# EAGLE schematic AIO (EAGLE 6.5.0)
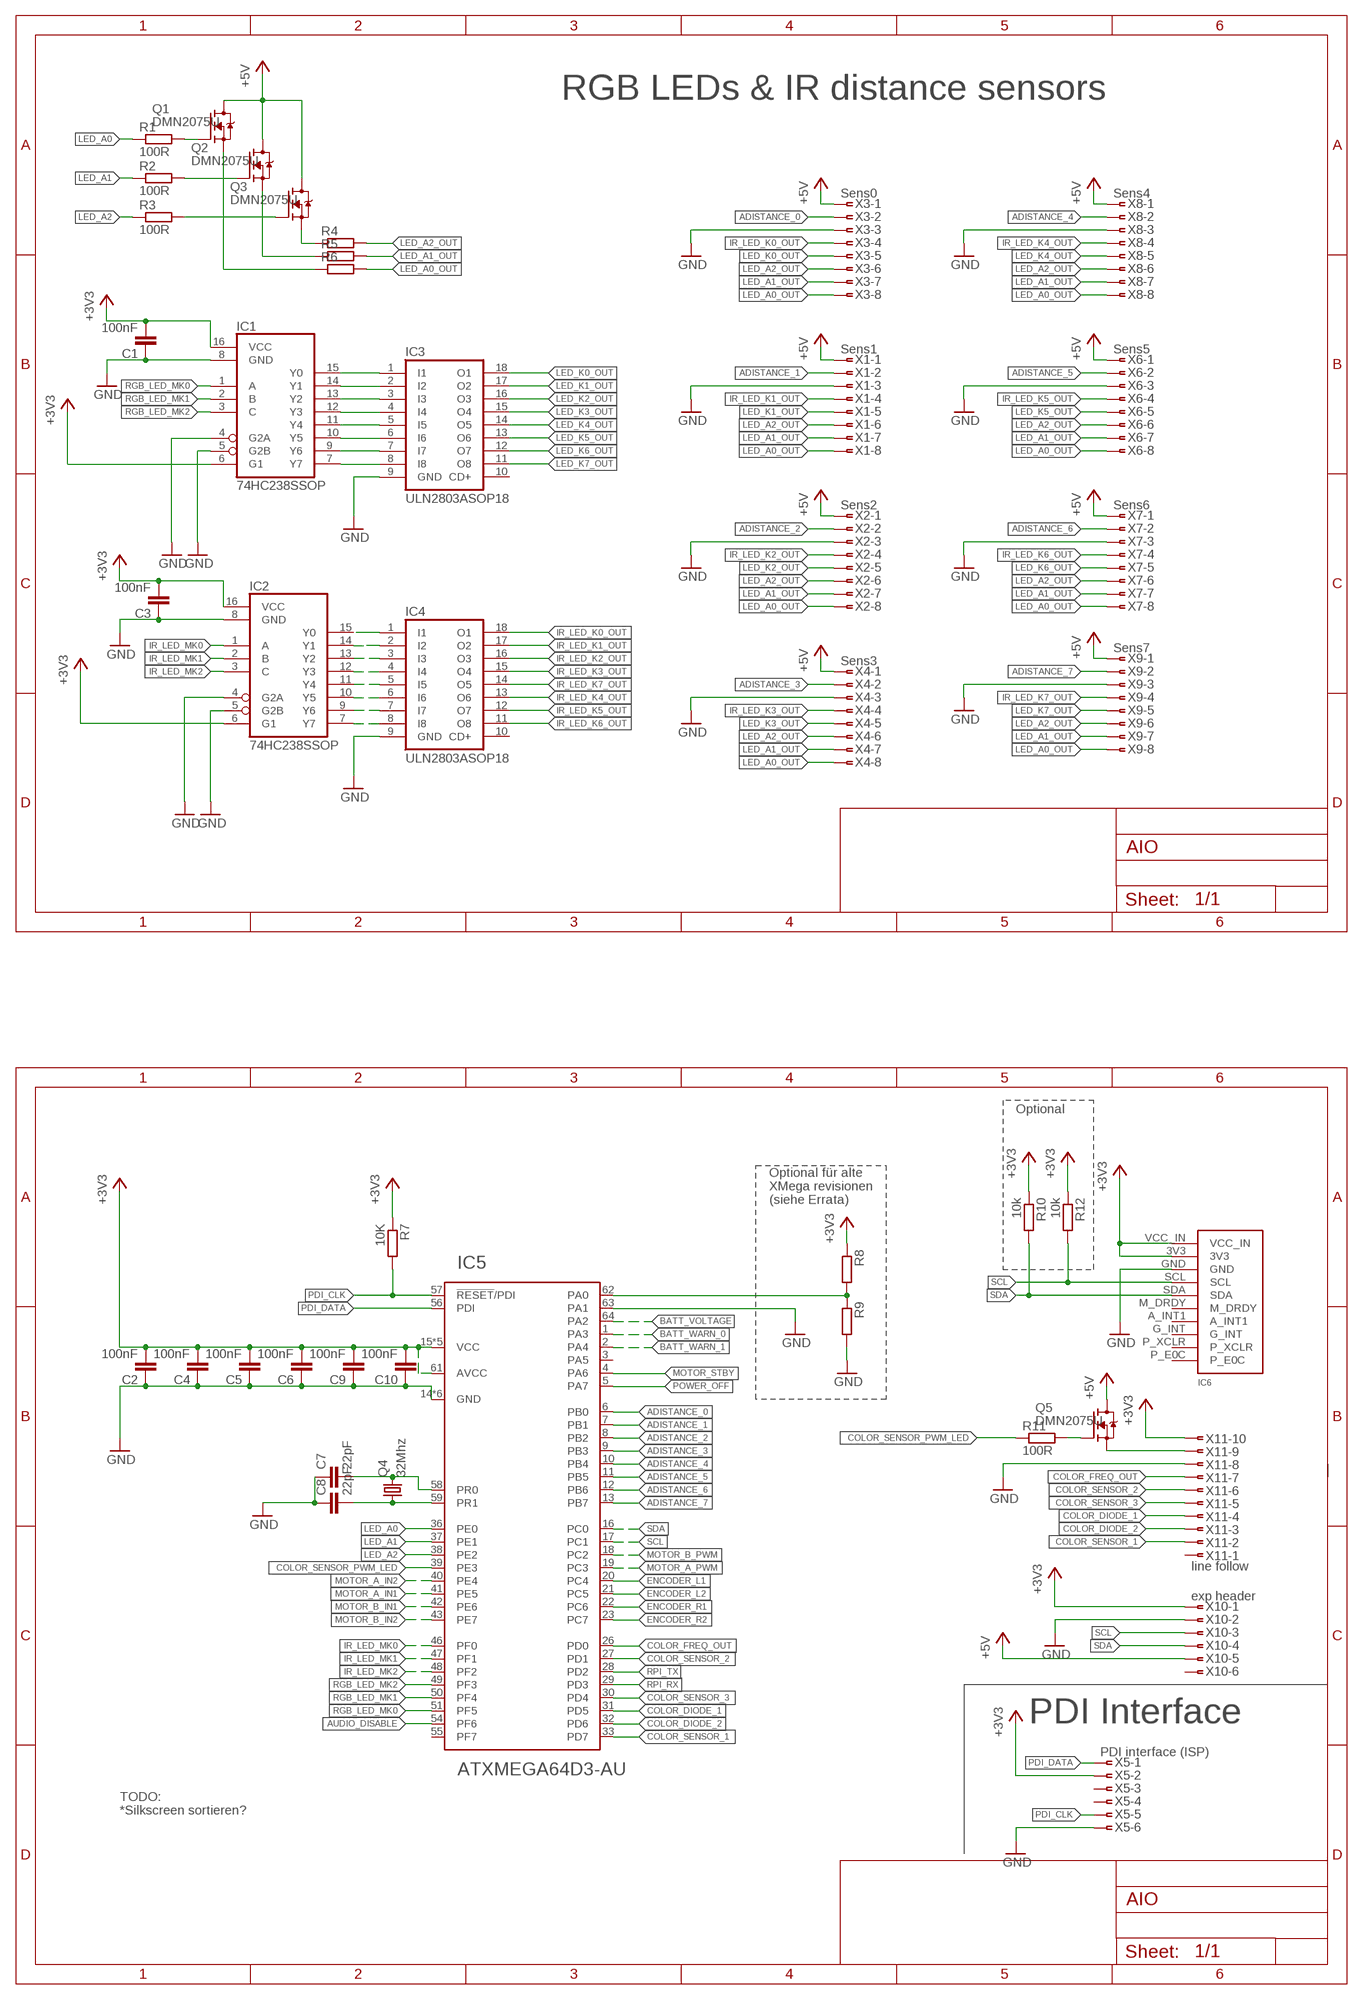
[diagram p0: schematic, sheet 1, part 1 of 2]
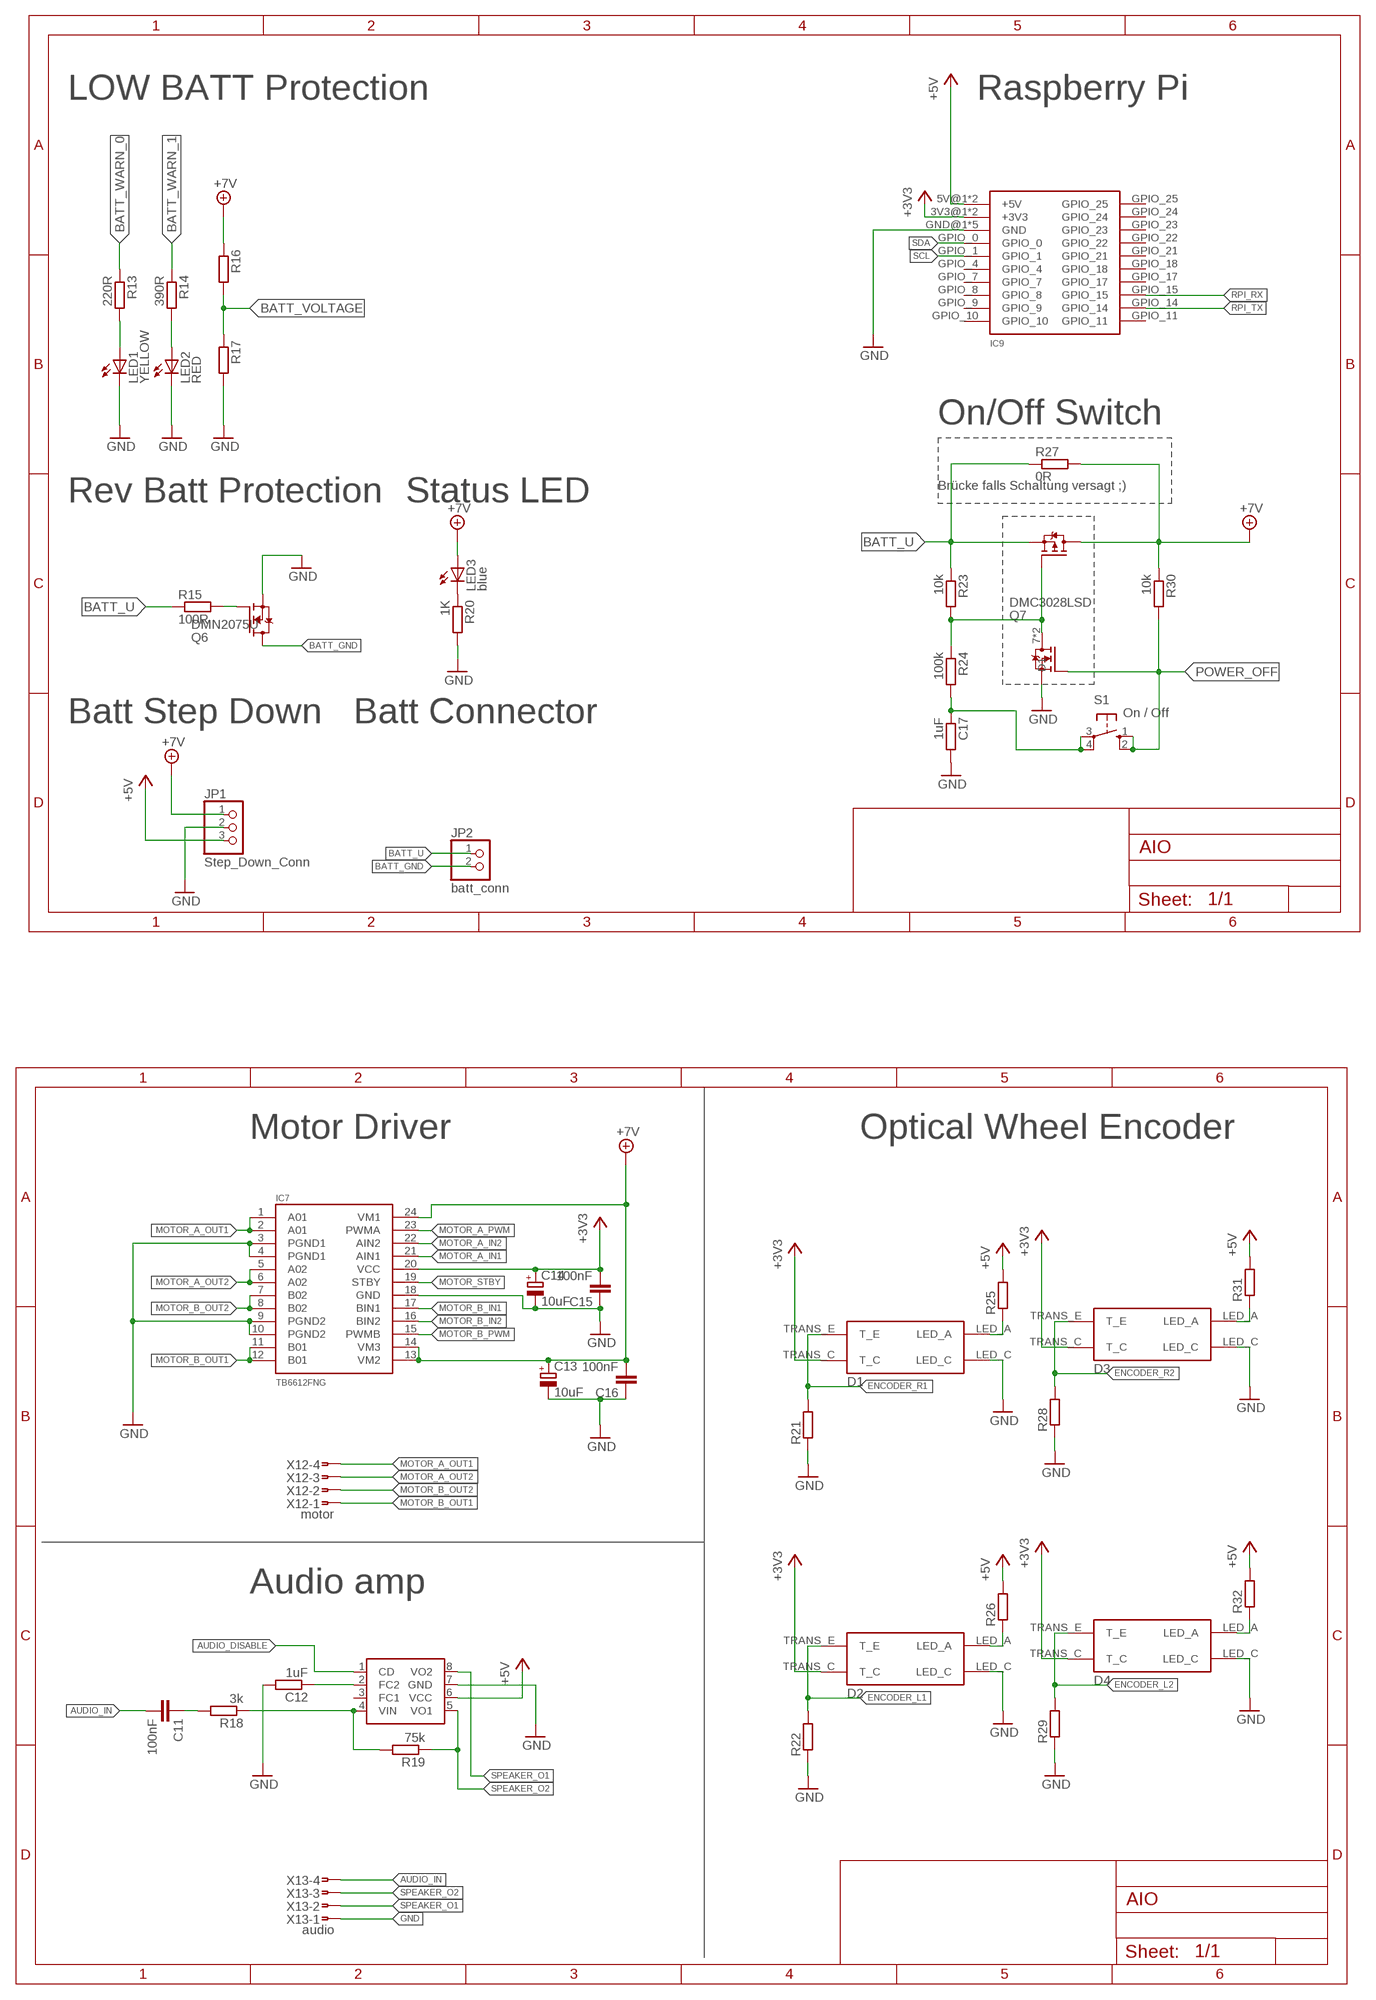
[diagram p1: schematic, sheet 1, part 2 of 2]

## Parts
C1  100nF  C-EUC0603  [C0603]
C2  100nF  C-EUC0603  [C0603]
C3  100nF  C-EUC0603  [C0603]
C4  100nF  C-EUC0603  [C0603]
C5  100nF  C-EUC0603  [C0603]
C6  100nF  C-EUC0603  [C0603]
C7  22pF  C-EUC0603  [C0603]
C8  22pF  C-EUC0603  [C0603]
C9  100nF  C-EUC0603  [C0603]
C10  100nF  C-EUC0603  [C0603]
C11  100nF  C-EUC0603  [C0603]
C12  1uF  R-EU_M0805  [M0805]
C13  10uF  CPOL-EUE2-5  [E2-5]
C14  10uF  CPOL-EUE2-5  [E2-5]
C15  100nF  C-EUC0603  [C0603]
C16  100nF  C-EUC0603  [C0603]
C17  1uF  R-EU_M0805  [M0805]
D1  CNY70  [CNY70]
D2  CNY70  [CNY70]
D3  CNY70  [CNY70]
D4  CNY70  [CNY70]
IC1  74HC238SSOP  [SSOP16]
IC2  74HC238SSOP  [SSOP16]
IC3  ULN2803ASOP18  [SOP18]
IC4  ULN2803ASOP18  [SOP18]
IC5  ATXMEGA64D3-AU  [TQFP-64A-64]
IC6  GY-81  [GY-81]
IC7  TB6612FNG  TB6621FNG  [SSOP24]
IC8  TS34119SMD  [SO08]
IC9  RASPBERRY-PI  [RASPERRRY-PI]
JP1  Step_Down_Conn  PINHD-1X3  [1X03]
JP2  batt_conn  PINHD-1X2  [1X02]
LED1  YELLOW  LEDCHIPLED_0603  [CHIPLED_0603]
LED2  RED  LEDCHIPLED_0603  [CHIPLED_0603]
LED3  blue  LEDCHIPLED_0603  [CHIPLED_0603]
Q1  DMN2075U  [SOT95P240X112-3N]
Q2  DMN2075U  [SOT95P240X112-3N]
Q3  DMN2075U  [SOT95P240X112-3N]
Q4  32Mhz  CRYSTALHC18U-V  [HC18U-V]
Q5  DMN2075U  [SOT95P240X112-3N]
Q6  DMN2075U  [SOT95P240X112-3N]
Q7  DMC3028LSD  [SO08]
R1  100R  R-EU_R0603  [R0603]
R2  100R  R-EU_R0603  [R0603]
R3  100R  R-EU_R0603  [R0603]
R4  R-EU_M0805  [M0805]
R5  R-EU_M0805  [M0805]
R6  R-EU_M0805  [M0805]
R7  10K  R-EU_M0805  [M0805]
R8  R-EU_M0805  [M0805]
R9  R-EU_M0805  [M0805]
R10  10k  R-EU_M0805  [M0805]
R11  100R  R-EU_R0603  [R0603]
R12  10k  R-EU_M0805  [M0805]
R13  220R  R-EU_M0805  [M0805]
R14  390R  R-EU_M0805  [M0805]
R15  100R  R-EU_R0603  [R0603]
R16  R-EU_M0805  [M0805]
R17  R-EU_M0805  [M0805]
R18  3k  R-EU_M0805  [M0805]
R19  75k  R-EU_M0805  [M0805]
R20  1K  R-EU_M0805  [M0805]
R21  R-EU_M0805  [M0805]
R22  R-EU_M0805  [M0805]
R23  10k  R-EU_M0805  [M0805]
R24  100k  R-EU_M0805  [M0805]
R25  R-EU_M0805  [M0805]
R26  R-EU_M0805  [M0805]
R27  0R  R-EU_M0805  [M0805]
R28  R-EU_M0805  [M0805]
R29  R-EU_M0805  [M0805]
R30  10k  R-EU_M0805  [M0805]
R31  R-EU_M0805  [M0805]
R32  R-EU_M0805  [M0805]
S1  On / Off  10-XX  [B3F-10XX]
X1  Sens1  FSIDE-8  [FSIDE-8]
X2  Sens2  FSIDE-8  [FSIDE-8]
X3  Sens0  FTOP-8  [FTOP-8]
X4  Sens3  FTOP-8  [FTOP-8]
X5  PDI interface (ISP)  FTOP-6  [FTOP-6]
X6  Sens5  FSIDE-8  [FSIDE-8]
X7  Sens6  FSIDE-8  [FSIDE-8]
X8  Sens4  FTOP-8  [FTOP-8]
X9  Sens7  FTOP-8  [FTOP-8]
X10  exp header  FTOP-6  [FTOP-6]
X11  line follow  FTOP-10  [FTOP-10]
X12  motor  FTOP-4  [FTOP-4]
X13  audio  FTOP-4  [FTOP-4]

## Nets
+3V3: C1.2 C2.2 C3.2 C4.2 C5.2 C6.2 C9.2 C10.2 C14.+ C15.2 D1.TRANS_C(T_C) D2.TRANS_C(T_C) D3.TRANS_C(T_C) D4.TRANS_C(T_C) IC1.6(G1) IC1.16(VCC) IC2.6(G1) IC2.16(VCC) IC5.15(VCC) IC5.25(VCC) IC5.35(VCC) IC5.45(VCC) IC5.53(VCC) IC5.61(AVCC) IC6.3V3 IC6.VCC_IN IC7.20(VCC) IC9.3V3@1(+3V3) IC9.3V3@2(+3V3) R7.1 R8.1 R10.1 R12.1 X5.2 X10.1 X11.10
+5V: IC8.6(VCC) IC9.5V@1(+5V) IC9.5V@2(+5V) JP1.3 Q1.D Q2.D Q3.D Q5.D R25.2 R26.2 R31.2 R32.2 X1.1 X2.1 X3.1 X4.1 X6.1 X7.1 X8.1 X9.1 X10.5
+7V: C13.+ C16.2 IC7.13(VM2) IC7.14(VM3) IC7.24(VM1) JP1.1 LED3.A Q7.5(D2) Q7.6(D2) R16.1 R27.2 R30.1
ADISTANCE_0: IC5.6(PB0) X3.2
ADISTANCE_1: IC5.7(PB1) X1.2
ADISTANCE_2: IC5.8(PB2) X2.2
ADISTANCE_3: IC5.9(PB3) X4.2
ADISTANCE_4: IC5.10(PB4) X8.2
ADISTANCE_5: IC5.11(PB5) X6.2
ADISTANCE_6: IC5.12(PB6) X7.2
ADISTANCE_7: IC5.13(PB7) X9.2
AUDIO_DISABLE: IC5.54(PF6) IC8.1(CD)
AUDIO_IN: C11.2 X13.4
BATT_GND: JP2.2 Q6.D
BATT_U: JP2.1 Q7.3(S2) R15.1 R23.1 R27.1
BATT_VOLTAGE: IC5.64(PA2) R16.2 R17.1
BATT_WARN_0: IC5.1(PA3) R13.1
BATT_WARN_1: IC5.2(PA4) R14.1
COLOR_DIODE_1: IC5.31(PD5) X11.4
COLOR_DIODE_2: IC5.32(PD6) X11.3
COLOR_FREQ_OUT: IC5.26(PD0) X11.7
COLOR_SENSOR_1: IC5.33(PD7) X11.2
COLOR_SENSOR_2: IC5.27(PD1) X11.6
COLOR_SENSOR_3: IC5.30(PD4) X11.5
COLOR_SENSOR_PWM_LED: IC5.39(PE3) R11.1
ENCODER_L1: D2.TRANS_E(T_E) IC5.20(PC4) R22.2
ENCODER_L2: D4.TRANS_E(T_E) IC5.21(PC5) R29.2
ENCODER_R1: D1.TRANS_E(T_E) IC5.22(PC6) R21.2
ENCODER_R2: D3.TRANS_E(T_E) IC5.23(PC7) R28.2
GND: C1.1 C2.1 C3.1 C4.1 C5.1 C6.1 C7.1 C8.1 C9.1 C10.1 C12.2 C13.- C14.- C15.1 C16.1 C17.2 D1.LED_C D2.LED_C D3.LED_C D4.LED_C IC1.4(G2A) IC1.5(G2B) IC1.8(GND) IC2.4(G2A) IC2.5(G2B) IC2.8(GND) IC3.9(GND) IC4.9(GND) IC5.14(GND) IC5.24(GND) IC5.34(GND) IC5.44(GND) IC5.52(GND) IC5.60(GND) IC5.63(PA1) IC6.GND IC7.3(PGND1) IC7.4(PGND1) IC7.9(PGND2) IC7.10(PGND2) IC7.18(GND) IC8.7(GND) IC9.GND@1(GND) IC9.GND@2(GND) IC9.GND@3(GND) IC9.GND@4(GND) IC9.GND@5(GND) JP1.2 LED1.C LED2.C Q6.S Q7.1(S1) R9.2 R17.2 R20.2 R21.1 R22.1 R28.1 R29.1 X1.3 X2.3 X3.3 X4.3 X5.6 X6.3 X7.3 X8.3 X9.3 X10.2 X11.8 X13.1
IR_LED_K0: IC2.15(Y0) IC4.1(I1)
IR_LED_K0_OUT: IC4.18(O1) X3.4
IR_LED_K1: IC2.14(Y1) IC4.2(I2)
IR_LED_K1_OUT: IC4.17(O2) X1.4
IR_LED_K2_OUT: IC4.16(O3) X2.4
IR_LED_K3_OUT: IC4.15(O4) X4.4
IR_LED_K4_OUT: IC4.13(O6) X8.4
IR_LED_K5_OUT: IC4.12(O7) X6.4
IR_LED_K6_OUT: IC4.11(O8) X7.4
IR_LED_K7_OUT: IC4.14(O5) X9.4
IR_LED_MK0: IC2.1(A) IC5.46(PF0)
IR_LED_MK1: IC2.2(B) IC5.47(PF1)
IR_LED_MK2: IC2.3(C) IC5.48(PF2)
LED_A0: IC5.36(PE0) R1.1
LED_A0_OUT: R6.2 X1.8 X2.8 X3.8 X4.8 X6.8 X7.8 X8.8 X9.8
LED_A1: IC5.37(PE1) R2.1
LED_A1_OUT: R5.2 X1.7 X2.7 X3.7 X4.7 X6.7 X7.7 X8.7 X9.7
LED_A2: IC5.38(PE2) R3.1
LED_A2_OUT: R4.2 X1.6 X2.6 X3.6 X4.6 X6.6 X7.6 X8.6 X9.6
LED_K0_OUT: IC3.18(O1) X3.5
LED_K1_OUT: IC3.17(O2) X1.5
LED_K2_OUT: IC3.16(O3) X2.5
LED_K3_OUT: IC3.15(O4) X4.5
LED_K4_OUT: IC3.14(O5) X8.5
LED_K5_OUT: IC3.13(O6) X6.5
LED_K6_OUT: IC3.12(O7) X7.5
LED_K7_OUT: IC3.11(O8) X9.5
MOTOR_A_IN1: IC5.41(PE5) IC7.21(AIN1)
MOTOR_A_IN2: IC5.40(PE4) IC7.22(AIN2)
MOTOR_A_OUT1: IC7.1(A01) IC7.2(A01) X12.4
MOTOR_A_OUT2: IC7.5(A02) IC7.6(A02) X12.3
MOTOR_A_PWM: IC5.19(PC3) IC7.23(PWMA)
MOTOR_B_IN1: IC5.42(PE6) IC7.17(BIN1)
MOTOR_B_IN2: IC5.43(PE7) IC7.16(BIN2)
MOTOR_B_OUT1: IC7.11(B01) IC7.12(B01) X12.1
MOTOR_B_OUT2: IC7.7(B02) IC7.8(B02) X12.2
MOTOR_B_PWM: IC5.18(PC2) IC7.15(PWMB)
MOTOR_STBY: IC5.4(PA6) IC7.19(STBY)
N$1: Q3.S R4.1
N$2: Q2.S R5.1
N$3: Q1.S R6.1
N$4: IC5.62(PA0) R8.2 R9.1
N$5: Q5.S X11.9
N$6: IC2.13(Y2) IC4.3(I3)
N$7: IC2.12(Y3) IC4.4(I4)
N$8: Q6.G R15.2
N$9: IC2.11(Y4) IC4.5(I5)
N$10: IC2.10(Y5) IC4.6(I6)
N$11: D4.LED_A R32.1
N$12: IC2.9(Y6) IC4.7(I7)
N$13: IC2.7(Y7) IC4.8(I8)
N$14: C8.2 IC5.59(PR1) Q4.1
N$15: IC8.4(VIN) R18.1 R19.2
N$16: C17.1 R24.2 S1.3(P) S1.4(P1)
N$17: C11.1 R18.2
N$18: C7.2 IC5.58(PR0) Q4.2
N$19: LED3.C R20.1
N$20: D1.LED_A R25.1
N$21: IC1.15(Y0) IC3.1(I1)
N$22: Q7.4(G2) Q7.7(D1) Q7.8(D1) R23.2 R24.1
N$23: D2.LED_A R26.1
N$24: IC1.14(Y1) IC3.2(I2)
N$25: Q5.G R11.2
N$26: D3.LED_A R31.1
N$27: IC1.13(Y2) IC3.3(I3)
N$28: IC1.12(Y3) IC3.4(I4)
N$29: LED2.A R14.2
N$30: IC1.11(Y4) IC3.5(I5)
N$31: IC1.10(Y5) IC3.6(I6)
N$32: LED1.A R13.2
N$33: IC1.9(Y6) IC3.7(I7)
N$34: IC1.7(Y7) IC3.8(I8)
N$36: C12.1 IC8.2(FC2)
N$38: Q1.G R1.2
N$39: Q2.G R2.2
N$40: Q3.G R3.2
PDI_CLK: IC5.57(!RESET!/PDI) R7.2 X5.5
PDI_DATA: IC5.56(PDI) X5.1
POWER_OFF: IC5.5(PA7) Q7.2(G1) R30.2 S1.1(S) S1.2(S1)
RGB_LED_MK0: IC1.1(A) IC5.51(PF5)
RGB_LED_MK1: IC1.2(B) IC5.50(PF4)
RGB_LED_MK2: IC1.3(C) IC5.49(PF3)
RPI_RX: IC5.29(PD3) IC9.GPIO_15
RPI_TX: IC5.28(PD2) IC9.GPIO_14
SCL: IC5.17(PC1) IC6.SCL IC9.GPIO_1 R12.2 X10.3
SDA: IC5.16(PC0) IC6.SDA IC9.GPIO_0 R10.2 X10.4
SPEAKER_O1: IC8.8(VO2) X13.2
SPEAKER_O2: IC8.5(VO1) R19.1 X13.3
Unconnected: IC3.10(CD+) IC4.10(CD+) IC5.3(PA5) IC5.55(PF7) IC6.A_INT1 IC6.G_INT IC6.M_DRDY IC6.P_E0C IC6.P_XCLR IC8.3(FC1) IC9.GPIO_4 IC9.GPIO_7 IC9.GPIO_8 IC9.GPIO_9 IC9.GPIO_10 IC9.GPIO_11 IC9.GPIO_17 IC9.GPIO_18 IC9.GPIO_21 IC9.GPIO_22 IC9.GPIO_23 IC9.GPIO_24 IC9.GPIO_25 X5.3 X5.4 X10.6 X11.1

## Notes on the sheet
- RGB LEDs & IR distance sensors | LOW BATT Protection | Raspberry Pi
- On/Off Switch
- Brücke falls Schaltung versagt ;)
- Rev Batt Protection | Status LED
- Batt Step Down | Batt Connector
- Optional
- Motor Driver | Optical Wheel Encoder
- Optional für alte
  XMega revisionen
  (siehe Errata)
- Audio amp
- PDI Interface
- TODO:
  *Silkscreen sortieren?

## Library data of the parts
C1-C11 C15 C16 = rcl:C-EU: CAPACITOR, European symbol
C12 C17 R4-R7 R10 R12-R14 R16-R32 = resistor:R-EU_: RESISTOR, European symbol
C13 C14 = rcl:CPOL-EU: POLARIZED CAPACITOR, European symbol
D1-D4 = BEEP:CNY70
IC1 IC2 = BEEP:74HC238: 3 to 8 line DECODER/DEMULTIPLEXER
IC3 IC4 = BEEP:ULN2803A: DRIVER ARRAY
IC5 = atmel-xmega:ATXMEGA64D3: 8/16-bit XMEGA C3 Microcontroller Features High-performance, Low-power 8/16-bit Atmel® AVR® XMEGATM Microcontroller Non-volatile Program and Data Memories – 64K - 256K Bytes of In-System Self-Programmable Flash – 4K - 8K Bytes Boot Code Section with Independent Lock Bits – 2K - 4K Bytes EEPROM – 4K - 16K Bytes Internal SRAM Peripheral Features – Four-channel Event System – Five 16-bit Timer/Counters Four Timer/Counters with 4 Output Compare or Input Capture channels One Timer/Counters with 2 Output Compare or Input Capture channels High Resolution Extensions on two Timer/Counters Advanced Waveform Extension on one Timer/Counter – Three USARTs IrDA Extension on 1 USART – Two Two-Wire Interfaces with dual address match(I2C and SMBus compatible) – Two SPI (Serial Peripheral Interfaces) – 16-bit Real Time Counter with Separate Oscillator – One Sixteen-channel, 12-bit, 200ksps Analog to Digital Converter – Two Analog Comparators with Window compare function – External Interrupts on all General Purpose I/O pins – Programmable Watchdog Timer with Separate On-chip Ultra Low Power Oscillator Special Microcontroller Features – Power-on Reset and Programmable Brown-out Detection – Internal and External Clock Options with PLL – Programmable Multi-level Interrupt Controller – Sleep Modes: Idle, Power-down, Standby, Power-save, Extended Standby – Advanced Programming, Test and Debugging Interface PDI (Program and Debug Interface) for programming, test and debugging I/O and Packages – 50 Programmable I/O Lines – 64-lead TQFP – 64-pad QFN Operating Voltage – 1.6 – 3.6V Speed performance – 0 – 12 MHz @ 1.6 – 3.6V – 0 – 32 MHz @ 2.7 – 3.6V
IC6 = BEEP:GY-81
IC7 = SparkFun-PowerIC:TB6621FNG: Toshiba 1A dual motor driver IC-09363; PROD_ID: IC-09363
IC8 = BEEP:TS34119
IC9 = BEEP:RASPBERRY-PI
JP1 = pinhead:PINHD-1X3: PIN HEADER
JP2 = pinhead:PINHD-1X2: PIN HEADER
LED1-LED3 = led:LED: LED OSRAM: - CHIPLED LG R971, LG N971, LY N971, LG Q971, LY Q971, LO R971, LY R971 LH N974, LH R974 LS Q976, LO Q976, LY Q976 LO Q996 - Hyper CHIPLED LW Q18S LB Q993, LB Q99A, LB R99A - SideLED LS A670, LO A670, LY A670, LG A670, LP A670 LB A673, LV A673, LT A673, LW A673 LH A674 LY A675 LS A676, LA A676, LO A676, LY A676, LW A676 LS A679, LY A679, LG A679 - Hyper Micro SIDELED® LS Y876, LA Y876, LO Y876, LY Y876 LT Y87S - SmartLED LW L88C, LW L88S LB L89C, LB L89S, LG L890 LS L89K, LO L89K, LY L89K LS L896, LA L896, LO L896, LY L896 - TOPLED LS T670, LO T670, LY T670, LG T670, LP T670 LSG T670, LSP T670, LSY T670, LOP T670, LYG T670 LG T671, LOG T671, LSG T671 LB T673, LV T673, LT T673, LW T673 LH T674 LS T676, LA T676, LO T676, LY T676, LB T676, LH T676, LSB T676, LW T676 LB T67C, LV T67C, LT T67C, LS T67K, LO T67K, LY T67K, LW E67C LS E67B, LA E67B, LO E67B, LY E67B, LB E67C, LV E67C, LT E67C LW T67C LS T679, LY T679, LG T679 LS T770, LO T770, LY T770, LG T770, LP T770 LB T773, LV T773, LT T773, LW T773 LH T774 LS E675, LA E675, LY E675, LS T675 LS T776, LA T776, LO T776, LY T776, LB T776 LHGB T686 LT T68C, LB T68C - Hyper Mini TOPLED® LB M676 - Mini TOPLED Santana® LG M470 LS M47K, LO M47K, LY M47K Source: http://www.osram.convergy.de LUXEON: - LUMILED® LXK2-PW12-R00, LXK2-PW12-S00, LXK2-PW14-U00, LXK2-PW14-V00 LXK2-PM12-R00, LXK2-PM12-S00, LXK2-PM14-U00 LXK2-PE12-Q00, LXK2-PE12-R00, LXK2-PE12-S00, LXK2-PE14-T00, LXK2-PE14-U00 LXK2-PB12-K00, LXK2-PB12-L00, LXK2-PB12-M00, LXK2-PB14-N00, LXK2-PB14-P00, LXK2-PB14-Q00 LXK2-PR12-L00, LXK2-PR12-M00, LXK2-PR14-Q00, LXK2-PR14-R00 LXK2-PD12-Q00, LXK2-PD12-R00, LXK2-PD12-S00 LXK2-PH12-R00, LXK2-PH12-S00 LXK2-PL12-P00, LXK2-PL12-Q00, LXK2-PL12-R00 Source: www.luxeon.com KINGBRIGHT: KA-3528ASYC Source: www.kingbright.com
Q1-Q3 Q5 Q6 = BEEP:DMN2075U
Q4 = crystal:CRYSTAL: CRYSTAL; OC_FARNELL: unknown; OC_NEWARK: unknown
Q7 = BEEP:DMC3028LSD
R1-R3 R8 R9 R11 R15 = rcl:R-EU_: RESISTOR, European symbol
S1 = switch-omron:10-XX: OMRON SWITCH; MPN: B3F-1000; OC_FARNELL: 176432; OC_NEWARK: 36M3542
X1 X2 X6 X7 = con-amp:FSIDE-8: AMP connector
X3 X4 X8 X9 = con-ftop-orientation-hole:FTOP-8: AMP connector
X5 X10 = con-ftop-orientation-hole:FTOP-6: AMP connector
X11 = con-ftop-orientation-hole:FTOP-10: AMP connector
X12 X13 = con-ftop-orientation-hole:FTOP-4: AMP connector